# EAGLE design esquematico inicial para a FRMF test (EAGLE 9.6.2)
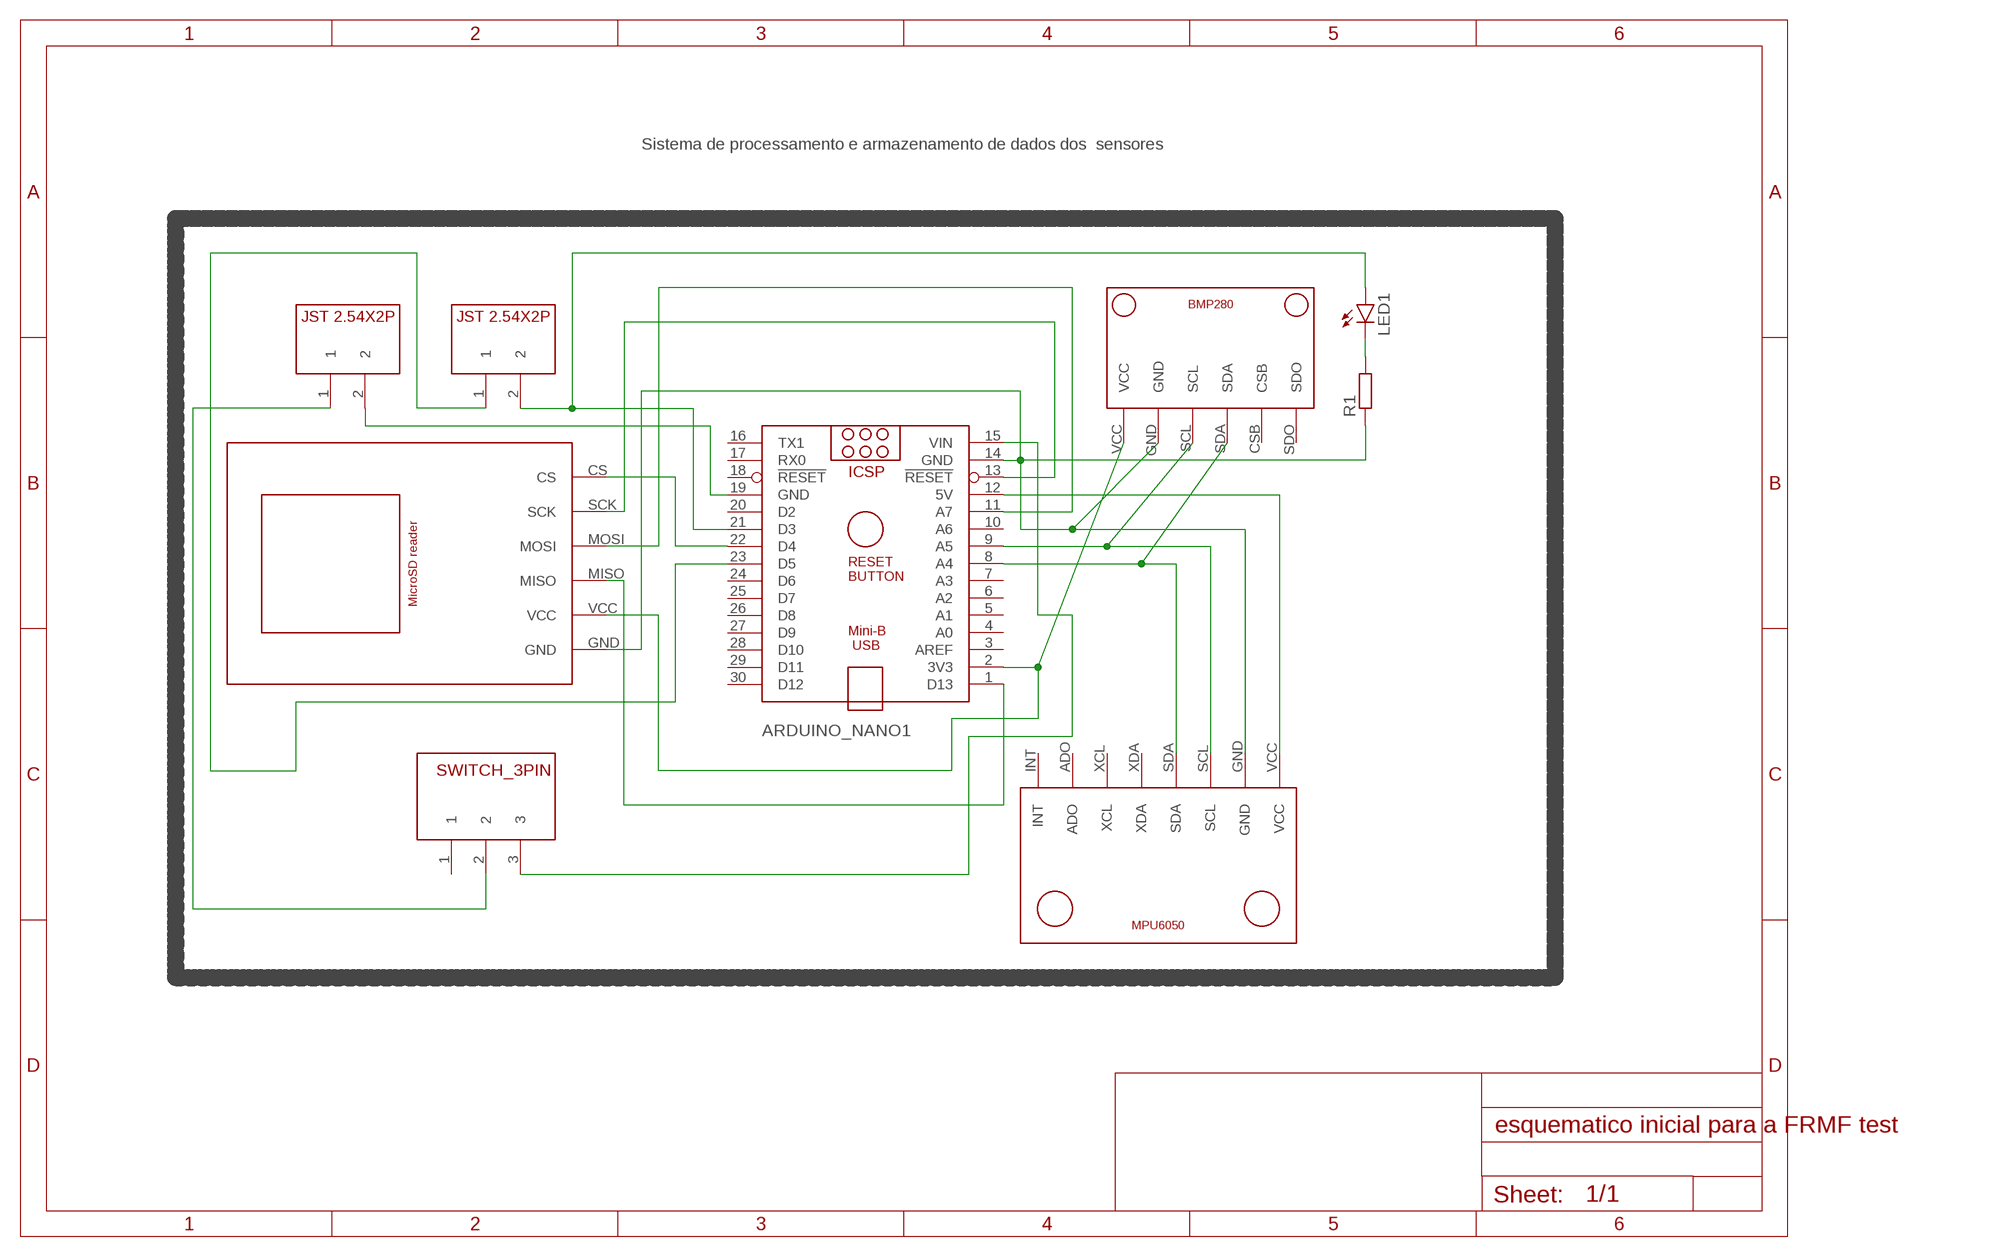
[diagram p0: schematic, sheet 1]

## Parts
ARDUINO_NANO1  ARDUINO_NANO  [ARDUINO_NANO]
LED1  LED5MM  [LED5MM]
R1  R-EU_0207/10  [0207/10]
U$1  BMP280V1  [BMP280_FOOTPRINT]
U$2  MPU6050V1  [MPU6050_FOOTPRINT]
U$3  MICROSD_READER  [MICROSD_READER_FOOTPRINT]
U$4  SWITCH_3PIN  [SWITCH_3PIN]
U$5  JST2.54X2P  [JST2.54X2P_FOOTPRINT]
U$6  JST2.54X2P  [JST2.54X2P_FOOTPRINT]

## Nets
N$1: ARDUINO_NANO1.2(3V3) U$1.VCC U$3.VCC
N$2: ARDUINO_NANO1.9(A5) U$1.SCL U$2.SCL
N$3: ARDUINO_NANO1.8(A4) U$1.SDA U$2.SDA
N$4: ARDUINO_NANO1.14(GND) R1.1 U$1.GND U$2.GND U$3.GND
N$5: ARDUINO_NANO1.12(5V) U$2.VCC
N$6: ARDUINO_NANO1.22(D4) U$3.CS
N$7: ARDUINO_NANO1.13(!RESET) U$3.SCK
N$8: ARDUINO_NANO1.11(A7) U$3.MOSI
N$9: ARDUINO_NANO1.1(D13) U$3.MISO
N$10: LED1.K(C) R1.2
N$11: ARDUINO_NANO1.21(D3) LED1.A U$5.2
N$12: ARDUINO_NANO1.19(GND) U$6.2
N$13: ARDUINO_NANO1.23(D5) U$5.1
N$14: ARDUINO_NANO1.15(VIN) U$4.3
N$15: U$4.2 U$6.1
Unconnected: ARDUINO_NANO1.3(AREF) ARDUINO_NANO1.4(A0) ARDUINO_NANO1.5(A1) ARDUINO_NANO1.6(A2) ARDUINO_NANO1.7(A3) ARDUINO_NANO1.10(A6) ARDUINO_NANO1.16(TX1) ARDUINO_NANO1.17(RX0) ARDUINO_NANO1.18(!RESET) ARDUINO_NANO1.20(D2) ARDUINO_NANO1.24(D6) ARDUINO_NANO1.25(D7) ARDUINO_NANO1.26(D8) ARDUINO_NANO1.27(D9) ARDUINO_NANO1.28(D10) ARDUINO_NANO1.29(D11) ARDUINO_NANO1.30(D12) U$1.CSB U$1.SDO U$2.ADO U$2.INT U$2.XCL U$2.XDA U$4.1

## Notes on the sheet
- Sistema de processamento e armazenamento de dados dos  sensores

## Library data of the parts
ARDUINO_NANO1 = ArduinoNanoV30:ARDUINO_NANO: Arduino Nano V3.0 Overview: The Arduino Nano is a small, complete, and breadboard-friendly board based on the ATmega328 (Arduino Nano 3.x) or ATmega168 (Arduino Nano 2.x). It has more or less the same functionality of the Arduino Duemilanove, but in a different package. It lacks only a DC power jack, and works with a Mini-B USB cable instead of a standard one. The Nano was designed and is being produced by Gravitech. Specifications: Microcontroller Atmel ATmega168 or ATmega328 Operating Voltage (logic level) 5 V Input Voltage (recommended) 7-12 V Input Voltage (limits) 6-20 V Digital I/O Pins 14 (of which 6 provide PWM output) Analog Input Pins 8 DC Current per I/O Pin 40 mA Flash Memory 16 KB (ATmega168) or 32 KB (ATmega328) of which 2 KB used by bootloader SRAM 1 KB (ATmega168) or 2 KB (ATmega328) EEPROM 512 bytes (ATmega168) or 1 KB (ATmega328) Clock Speed 16 MHz Dimensions 0.73" x 1.70" Length 45 mm Width 18 mm Weigth 5 g Power: The Arduino Nano can be powered via the Mini-B USB connection, 6-20V unregulated external power supply (pin 30), or 5V regulated external power supply (pin 27). The power source is automatically selected to the highest voltage source. Memory: The ATmega168 has 16 KB of flash memory for storing code (of which 2 KB is used for the bootloader); the ATmega328 has 32 KB, (also with 2 KB used for the bootloader). The ATmega168 has 1 KB of SRAM and 512 bytes of EEPROM (which can be read and written with the EEPROM library); the ATmega328 has 2 KB of SRAM and 1 KB of EEPROM. Input and Output: Each of the 14 digital pins on the Nano can be used as an input or output, using pinMode(), digitalWrite(), and digitalRead() functions. They operate at 5 volts. Each pin can provide or receive a maximum of 40 mA and has an internal pull-up resistor (disconnected by default) of 20-50 kOhms. In addition, some pins have specialized functions. Visit Arduino - ArduinoBoardNano <https://www.arduino.cc/en/Main/ArduinoBoardNano>
LED1 = led:LED: LED OSRAM: - CHIPLED LG R971, LG N971, LY N971, LG Q971, LY Q971, LO R971, LY R971 LH N974, LH R974 LS Q976, LO Q976, LY Q976 LO Q996 - Hyper CHIPLED LW Q18S LB Q993, LB Q99A, LB R99A - SideLED LS A670, LO A670, LY A670, LG A670, LP A670 LB A673, LV A673, LT A673, LW A673 LH A674 LY A675 LS A676, LA A676, LO A676, LY A676, LW A676 LS A679, LY A679, LG A679 - Hyper Micro SIDELED® LS Y876, LA Y876, LO Y876, LY Y876 LT Y87S - SmartLED LW L88C, LW L88S LB L89C, LB L89S, LG L890 LS L89K, LO L89K, LY L89K LS L896, LA L896, LO L896, LY L896 - TOPLED LS T670, LO T670, LY T670, LG T670, LP T670 LSG T670, LSP T670, LSY T670, LOP T670, LYG T670 LG T671, LOG T671, LSG T671 LB T673, LV T673, LT T673, LW T673 LH T674 LS T676, LA T676, LO T676, LY T676, LB T676, LH T676, LSB T676, LW T676 LB T67C, LV T67C, LT T67C, LS T67K, LO T67K, LY T67K, LW E67C LS E67B, LA E67B, LO E67B, LY E67B, LB E67C, LV E67C, LT E67C LW T67C LS T679, LY T679, LG T679 LS T770, LO T770, LY T770, LG T770, LP T770 LB T773, LV T773, LT T773, LW T773 LH T774 LS E675, LA E675, LY E675, LS T675 LS T776, LA T776, LO T776, LY T776, LB T776 LHGB T686 LT T68C, LB T68C - Hyper Mini TOPLED® LB M676 - Mini TOPLED Santana® LG M470 LS M47K, LO M47K, LY M47K Source: http://www.osram.convergy.de LUXEON: - LUMILED® LXK2-PW12-R00, LXK2-PW12-S00, LXK2-PW14-U00, LXK2-PW14-V00 LXK2-PM12-R00, LXK2-PM12-S00, LXK2-PM14-U00 LXK2-PE12-Q00, LXK2-PE12-R00, LXK2-PE12-S00, LXK2-PE14-T00, LXK2-PE14-U00 LXK2-PB12-K00, LXK2-PB12-L00, LXK2-PB12-M00, LXK2-PB14-N00, LXK2-PB14-P00, LXK2-PB14-Q00 LXK2-PR12-L00, LXK2-PR12-M00, LXK2-PR14-Q00, LXK2-PR14-R00 LXK2-PD12-Q00, LXK2-PD12-R00, LXK2-PD12-S00 LXK2-PH12-R00, LXK2-PH12-S00 LXK2-PL12-P00, LXK2-PL12-Q00, LXK2-PL12-R00 Source: www.luxeon.com KINGBRIGHT: KA-3528ASYC Source: www.kingbright.com
R1 = rcl:R-EU_: RESISTOR, European symbol; SPICEPREFIX: R
U$1 = CRD:BMP280: Sensor barométrico
U$2 = CRD:MPU6050: Acelerômetro e Giroscópio
U$3 = CRD:MICROSD_READER: Leitor e gravador de cartão SD
U$4 = CRD:SWITCH_3PIN
U$5 U$6 = CRD:JST2.54X2P: Conector JST 2 pinos (2.54mm de distância entre pinos)

## Board
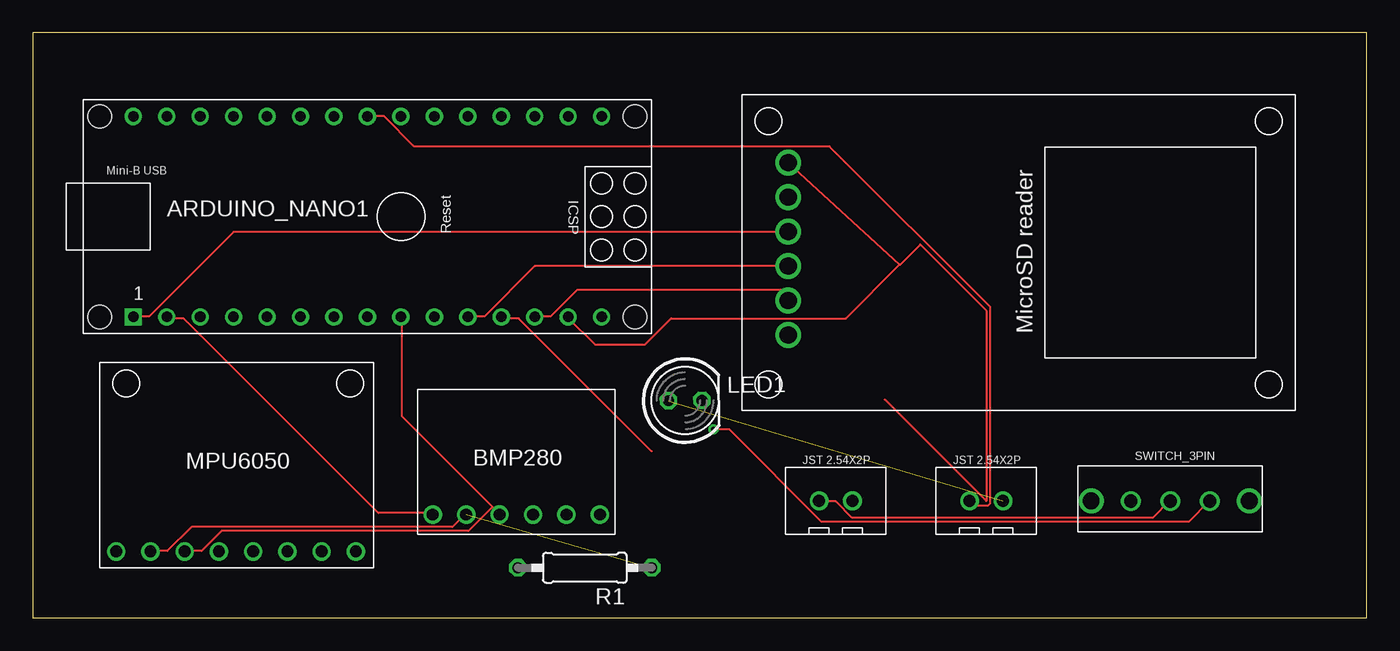
[diagram p1: board, top side]
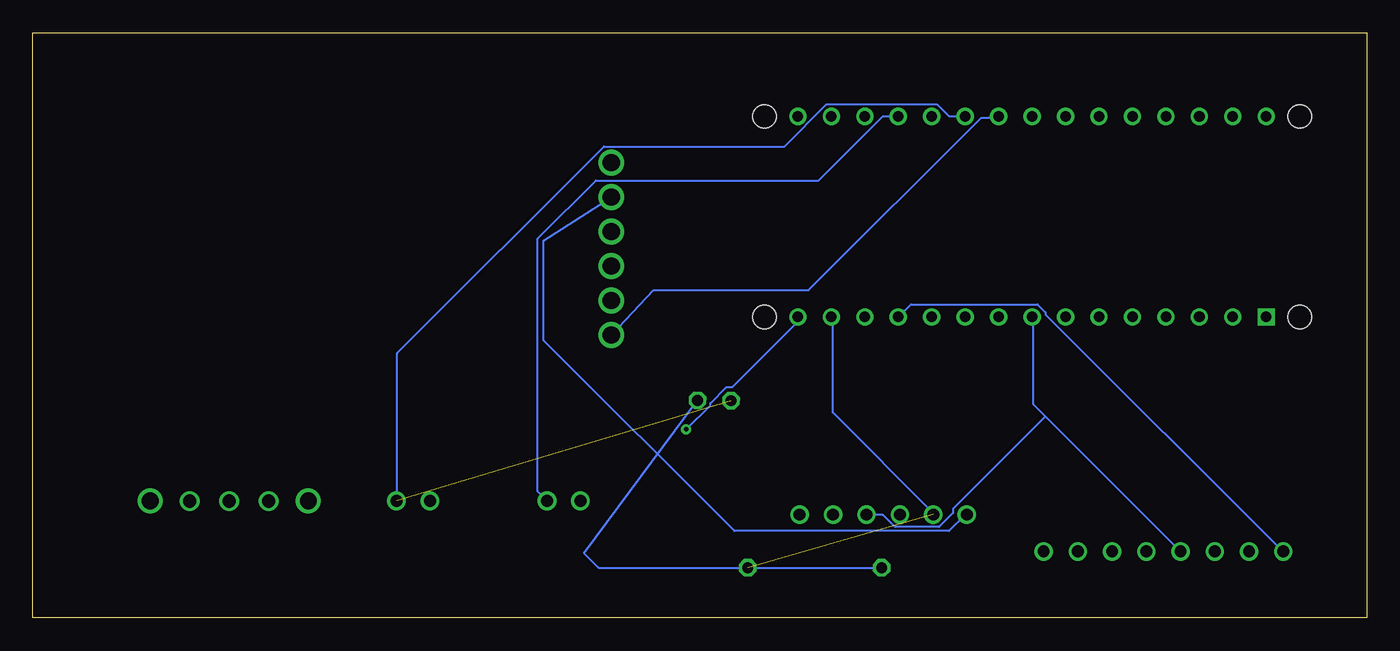
[diagram p2: board, bottom side, seen from below]

Size 101.27 x 44.44 mm. Coordinates in mm from the lower left corner, seen from the top.
Outline: 0,0 101.27,0 101.27,44.44 0,44.44 0,0
Copper layers (1*16): Top 0.035mm / dielectric 1.5mm / Bottom 0.035mm
Design rules "default": minimum track width 6mil, minimum drill 0.35mm, track to track 6mil, track to pad 6mil, pad to pad 6mil, via to via 6mil, smd to smd 6mil, copper to edge 40mil, drill to drill 6mil, minimum pad ring 10mil, minimum via ring 8mil, stop-mask expansion 4mil, vias tented up to drill 0mil, thermal gap 10mil

### Footprints (pad centres in the part's own frame; a part is rotated, then mirrored left to right if it is on the bottom)
ARDUINO_NANO = drill 0.8 square: 1 -20.32,-7.62 | drill 0.8: 2 -17.78,-7.62; 3 -15.24,-7.62; 4 -12.7,-7.62; 5 -10.16,-7.62; 6 -7.62,-7.62; 7 -5.08,-7.62; 8 -2.54,-7.62; 9 0,-7.62; 10 2.54,-7.62; 11 5.08,-7.62; 12 7.62,-7.62; 13 10.16,-7.62; 14 12.7,-7.62; 15 15.24,-7.62; 16 15.24,7.62; 17 12.7,7.62; 18 10.16,7.62; 19 7.62,7.62; 20 5.08,7.62; 21 2.54,7.62; 22 0,7.62; 23 -2.54,7.62; 24 -5.08,7.62; 25 -7.62,7.62; 26 -10.16,7.62; 27 -12.7,7.62; 28 -15.24,7.62; 29 -17.78,7.62; 30 -20.32,7.62 | hole 1.778: -22.86,-7.62; -22.86,7.62; 17.78,7.62; 17.78,-7.62
LED5MM = drill 0.813 octagon: A -1.27,0; K 1.27,0
0207/10 = drill 0.813 octagon: 1 -5.08,0; 2 5.08,0
BMP280_FOOTPRINT = drill 0.891: CSB 3.686,-6.12; GND -3.934,-6.12; SCL -1.395,-6.12; SDA 1.145,-6.12; SDO 6.226,-6.12; VCC -6.474,-6.12
MPU6050_FOOTPRINT = drill 0.891: ADO 6.686,-10.184; GND -6.314,-10.184; INT 9.286,-10.184; SCL -3.715,-10.184; SDA -1.115,-10.184; VCC -8.915,-10.184; XCL 4.085,-10.184; XDA 1.486,-10.184
MICROSD_READER_FOOTPRINT = drill 1.3: CS 6.449,-8.692; GND -6.651,-8.692; MISO -1.411,-8.692; MOSI 1.209,-8.692; SCK 3.829,-8.692; VCC -4.031,-8.692
SWITCH_3PIN = drill 1: 1 -3,-0.018; 2 0,-0.018; 3 3,-0.018 | drill 1.27: P$1 -6,0; P$2 6,0
JST2.54X2P_FOOTPRINT = drill 0.9: 1 -1.27,0; 2 1.27,0

### Placement (x,y rotation side)
ARDUINO_NANO1  27.94,30.48 0 top
LED1  49.53,16.51 0.7 top
R1  41.91,3.81 180 top
U$1  36.83,13.97 0 top
U$2  15.24,15.24 0 top
U$3  66.04,27.94 270 top
U$4  86.36,8.89 0 top
U$5  72.39,8.89 0 top
U$6  60.96,8.89 0 top

### Tracks (layer width: path | path; a pad name or v marks a point on that pad's centre or on a via)
N$1
  Top 0.152: ARDUINO_NANO1.2 10.21,22.76 11.43,22.76 26.21,7.98 30.33,7.98 U$1.VCC
  Bottom 0.152: U$3.VCC 62.48,28.67 62.48,21.08 48.01,6.6 31.7,6.6 30.48,7.82 U$1.VCC
N$2
  Top 0.152: 34.9,8.43 35.36,7.98 U$1.SCL | 34.9,8.43 28.04,15.29 28.04,22.76 ARDUINO_NANO1.9 | 34.9,8.43 33.07,6.6 14.33,6.6 12.8,5.08 11.58,5.08 U$2.SCL
N$3
  Bottom 0.152: 24.38,15.29 14.17,5.08 U$2.SDA | 24.38,15.29 25.3,16.2 25.3,22.76 ARDUINO_NANO1.8 | 24.38,15.29 31.39,8.28 31.39,7.98 32.46,6.91 35.81,6.91 36.73,7.82 37.95,7.82 U$1.SDA
N$4  (1 unrouted)
  Top 0.152: 67.36,28.4 67.39,28.37 | 67.39,28.37 72.39,23.37 72.39,8.89 64.69,16.59 | 65.81,26.84 U$3.GND | U$2.GND 8.99,5.08 10.21,5.08 12.04,6.91 31.85,6.91 32.77,7.82 U$1.GND | 65.81,26.84 61.72,22.76 48.46,22.76 46.48,20.78 42.67,20.78 40.69,22.76 ARDUINO_NANO1.14 | 67.39,28.37 65.84,26.82 65.81,26.84
  Bottom 0.152: ARDUINO_NANO1.14 40.54,22.76 40.54,15.6 32.92,7.98 U$1.GND
N$5
  Top 0.152: 46.99,12.65 36.88,22.76 35.66,22.76 ARDUINO_NANO1.12
  Bottom 0.152: ARDUINO_NANO1.12 34.59,23.82 24.99,23.82 24.38,23.22 24.38,23.06 6.4,5.08 U$2.VCC
N$6
  Bottom 0.152: ARDUINO_NANO1.22 28.04,38 29.26,38 42.37,24.89 54.13,24.89 U$3.CS
N$7
  Top 0.152: ARDUINO_NANO1.13 38.1,22.91 39.32,22.91 41.3,24.89 57.02,24.89 U$3.SCK
N$8
  Top 0.152: ARDUINO_NANO1.11 33.07,22.91 34.29,22.91 38.1,26.72 57.3,26.72 U$3.MOSI
N$9
  Top 0.152: ARDUINO_NANO1.1 7.62,22.91 8.84,22.91 15.24,29.31 57.3,29.31 U$3.MISO
N$10
  Bottom 0.152: R1.2 58.32,3.81 59.41,4.91 LED1.K
N$11  (1 unrouted)
  Bottom 0.152: ARDUINO_NANO1.21 31.7,38.1 32.61,39.01 41,39.01 44.2,35.81 57.91,35.81 73.61,20.12 73.61,8.99 U$5.2
N$12
  Bottom 0.152: ARDUINO_NANO1.19 36.73,38.1 41.6,33.22 58.52,33.22 62.94,28.8 62.94,9.6 U$6.2
N$13
  Top 0.152: ARDUINO_NANO1.23 26.67,38.1 28.96,35.81 60.5,35.81 72.69,23.62 72.69,8.69 72.54,8.53 71.48,8.53 U$5.1
N$14  (via drill 0.35)
  Top 0.152: v51.66,14.33 52.88,14.33 59.89,7.32 87.78,7.32 89.31,8.84 U$4.3
  Bottom 0.152: v51.66,14.33 49.84,16.15 49.84,16.31 48.62,17.53 48.16,17.53 43.28,22.4 43.28,22.86 ARDUINO_NANO1.15
N$15
  Top 0.152: U$6.1 59.74,8.84 60.96,8.84 62.18,7.62 85.04,7.62 86.26,8.84 U$4.2